# EAGLE design time-twister (EAGLE 6.6.0)

## Sheet 1 of 3
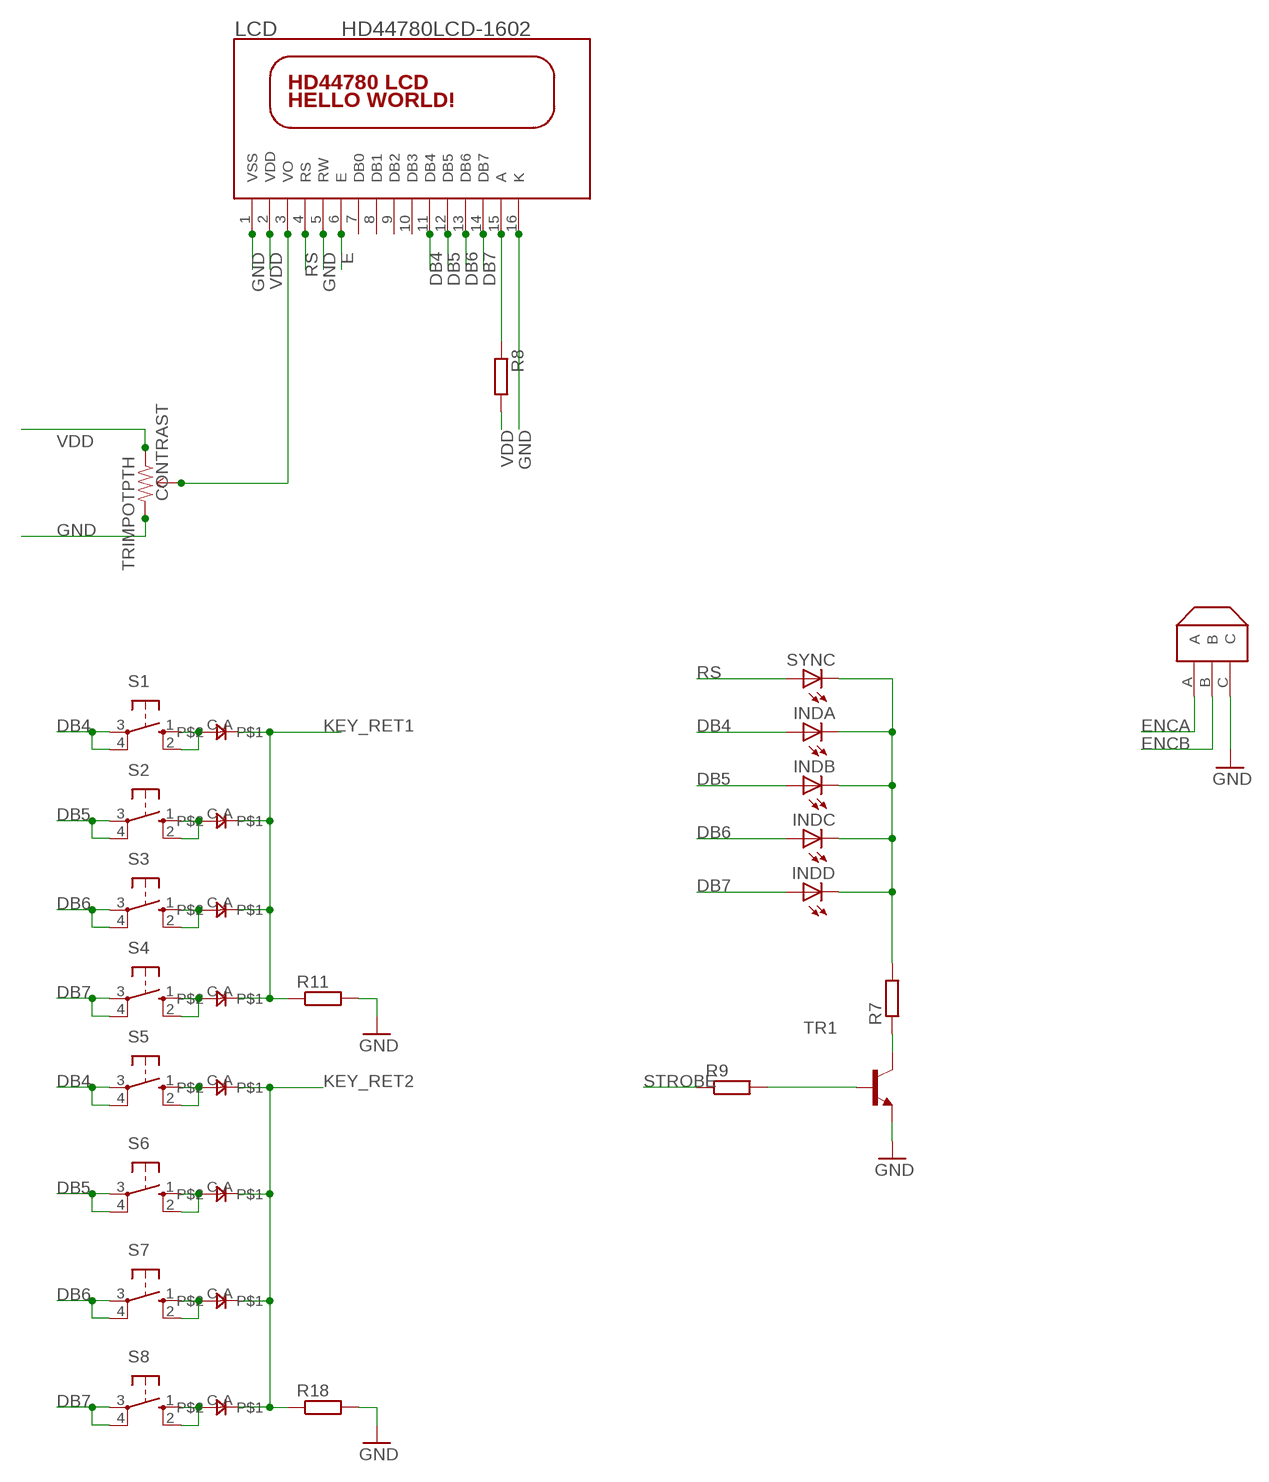
[diagram p0: schematic, sheet 1]

### Parts
CONTRAST  TRIMPOTPTH  [TRIM_POT_PTH]
D5  0805DIODE  [0805DIODE]
D6  0805DIODE  [0805DIODE]
D7  0805DIODE  [0805DIODE]
D8  0805DIODE  [0805DIODE]
D10  0805DIODE  [0805DIODE]
D11  0805DIODE  [0805DIODE]
D12  0805DIODE  [0805DIODE]
D13  0805DIODE  [0805DIODE]
ENC1  ENCODER  [ENCODER]
INDA  LED3MM  [LED3MM]
INDB  LED3MM  [LED3MM]
INDC  LED3MM  [LED3MM]
INDD  LED3MM  [LED3MM]
LCD  HD44780LCD-1602  [LCD1602]
R7  R-EU_R0805  [R0805]
R8  R-EU_R0805  [R0805]
R9  R-EU_R0805  [R0805]
R11  R-EU_R0805  [R0805]
R18  R-EU_R0805  [R0805]
S1  40-XX  [B3F-40XX]
S2  40-XX  [B3F-40XX]
S3  40-XX  [B3F-40XX]
S4  40-XX  [B3F-40XX]
S5  40-XX  [B3F-40XX]
S6  40-XX  [B3F-40XX]
S7  40-XX  [B3F-40XX]
S8  40-XX  [B3F-40XX]
SYNC  LED3MM  [LED3MM]
TR1  MMBT3904LT1-NPN-SOT23-BEC  [SOT23-BEC]

### Nets
DB4: INDA.A LCD.11(DB4) S1.3(P) S1.4(P1) S5.3(P) S5.4(P1) ; also sheet 2
DB5: INDB.A LCD.12(DB5) S2.3(P) S2.4(P1) S6.3(P) S6.4(P1) ; also sheet 2
DB6: INDC.A LCD.13(DB6) S3.3(P) S3.4(P1) S7.3(P) S7.4(P1) ; also sheet 2
DB7: INDD.A LCD.14(DB7) S4.3(P) S4.4(P1) S8.3(P) S8.4(P1) ; also sheet 2
E: LCD.6(E) ; also sheet 2
ENCA: ENC1.A ; also sheet 2
ENCB: ENC1.B ; also sheet 2
GND: CONTRAST.3(CW) ENC1.C LCD.1(VSS) LCD.5(RW) LCD.16(K) R11.2 R18.2 TR1.E ; also sheet 2,3
INDC: INDA.K(C) INDB.K(C) INDC.K(C) INDD.K(C) R7.2 SYNC.K(C)
KEY_RET1: D10.A D11.A D12.A D13.A R11.1 ; also sheet 2
KEY_RET2: D5.A D6.A D7.A D8.A R18.1 ; also sheet 2
LCD_A: LCD.15(A) R8.1
LCD_VO: CONTRAST.2(WIPER) LCD.3(VO)
N$21: R7.1 TR1.C
N$22: D12.C S1.1(S) S1.2(S1)
N$23: D10.C S2.1(S) S2.2(S1)
N$28: D13.C S3.1(S) S3.2(S1)
N$29: D11.C S4.1(S) S4.2(S1)
N$30: D8.C S5.1(S) S5.2(S1)
N$31: D7.C S6.1(S) S6.2(S1)
N$32: D6.C S7.1(S) S7.2(S1)
N$33: D5.C S8.1(S) S8.2(S1)
N$34: R9.2 TR1.B
RS: LCD.4(RS) SYNC.A ; also sheet 2
STROBE: R9.1 ; also sheet 2
VDD: CONTRAST.1(CCW) LCD.2(VDD) R8.2 ; also sheet 2,3
Unconnected: LCD.7(DB0) LCD.8(DB1) LCD.9(DB2) LCD.10(DB3)

## Sheet 2 of 3
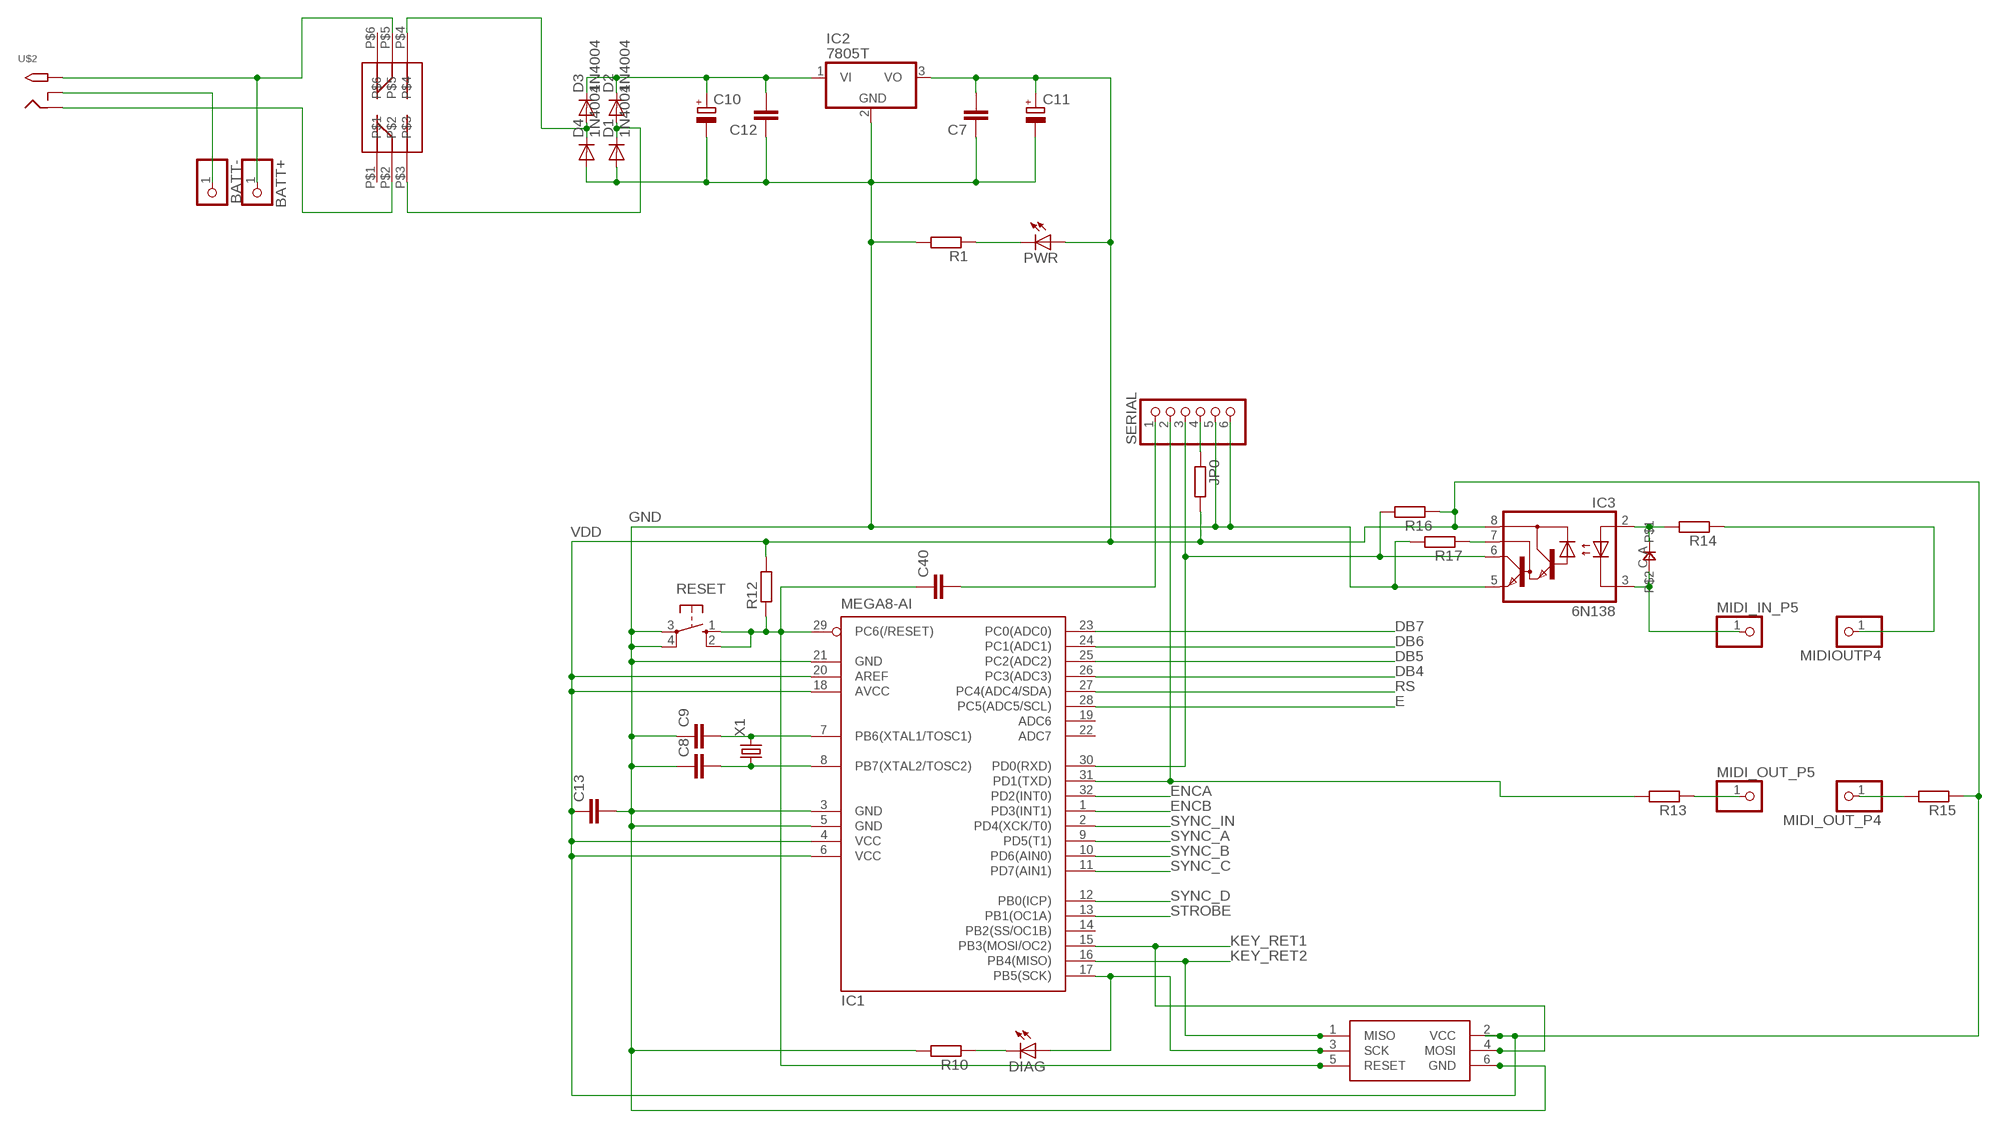
[diagram p1: schematic, sheet 2]

### Parts
BATT+  HEADER-1X1  [1X01_OVAL]
BATT-  HEADER-1X1  [1X01_OVAL]
C7  C-EUC0805  [C0805]
C8  C-EUC0805  [C0805]
C9  C-EUC0805  [C0805]
C10  CPOL-EUE2.5-6  [E2,5-6]
C11  CPOL-EUE2.5-6  [E2,5-6]
C12  C-EUC0805  [C0805]
C13  C-EUC0805  [C0805]
C40  C-EUC0805  [C0805]
D1  1N4004  [DO-VERT]
D2  1N4004  [DO-VERT]
D3  1N4004  [DO-VERT]
D4  1N4004  [DO-VERT]
D9  0805DIODE  [0805DIODE]
DIAG  LED3MM  [LED3MM]
IC1  MEGA8-AI  [TQFP32-08]
IC2  7805T  [TO220H]
IC3  6N138  [DIL08]
JP0  R-EU_R0805  [R0805]
MIDI_IN_P5  HEADER-1X1  [1X01_OVAL]
MIDI_OUT_P4  HEADER-1X1  [1X01_OVAL]
MIDI_OUT_P5  HEADER-1X1  [1X01_OVAL]
MIDIOUTP4  HEADER-1X1  [1X01_OVAL]
ONOFF  2P2T_LATCHING  [2P2T_LATCHING]
PWR  LED3MM  [LED3MM]
R1  R-EU_R0805  [R0805]
R10  R-EU_R0805  [R0805]
R12  R-EU_R0805  [R0805]
R13  R-EU_R0805  [R0805]
R14  R-EU_R0805  [R0805]
R15  R-EU_R0805  [R0805]
R16  R-EU_R0805  [R0805]
R17  R-EU_R0805  [R0805]
RESET  10-XX  [B3F-10XX]
SERIAL  PINHD-1X6  [1X06]
U$2  2.1MMJACKTHM  [PJ-102A]
U$34  TAG_CONN_AVR  [TC2030-MCP-NL]
X1  CRYSTALHC49S  [HC49/S]

### Nets
BLINK: DIAG.A IC1.17(PB5(SCK)) U$34.3(SCK)
DB4: IC1.26(PC3(ADC3)) ; also sheet 1
DB5: IC1.25(PC2(ADC2)) ; also sheet 1
DB6: IC1.24(PC1(ADC1)) ; also sheet 1
DB7: IC1.23(PC0(ADC0)) ; also sheet 1
E: IC1.28(PC5(ADC5/SCL)) ; also sheet 1
ENCA: IC1.32(PD2(INT0)) ; also sheet 1
ENCB: IC1.1(PD3(INT1)) ; also sheet 1
GND: C7.1 C8.1 C9.1 C10.- C11.- C12.1 C13.2 D1.A D4.A IC1.3(GND) IC1.5(GND) IC1.21(GND) IC2.2(GND) IC3.5(GND) R1.2 R10.2 R17.2 RESET.3(P) RESET.4(P1) SERIAL.5 SERIAL.6 U$34.6(GND) ; also sheet 1,3
KEY_RET1: IC1.15(PB3(MOSI/OC2)) U$34.4(MOSI) ; also sheet 1
KEY_RET2: IC1.16(PB4(MISO)) U$34.1(MISO) ; also sheet 1
MIDI_IN_4: MIDI_OUT_P4.1 R15.2
MIDI_IN_P4: MIDIOUTP4.1 R14.1
MIDI_OUT_5: D9.C IC3.3(C) MIDI_IN_P5.1
MIDI_OUT_P5: MIDI_OUT_P5.1 R13.1
N$4: C9.2 IC1.7(PB6(XTAL1/TOSC1)) X1.2
N$5: C8.2 IC1.8(PB7(XTAL2/TOSC2)) X1.1
N$7: C40.1 IC1.29(PC6(/RESET)) R12.1 RESET.1(S) RESET.2(S1) U$34.5(RESET)
N$8: JP0.1 SERIAL.4
N$9: C40.2 SERIAL.1
N$10: IC1.31(PD1(TXD)) R13.2 SERIAL.2
N$11: IC1.30(PD0(RXD)) IC3.6(VO) R16.2 SERIAL.3
N$12: C10.+ C12.2 D2.C D3.C IC2.1(VI)
N$41: BATT+.1 ONOFF.P$5 U$2.TIP
N$42: ONOFF.P$2 U$2.RING
N$43: BATT-.1 U$2.RING_SW
N$44: IC3.7(VB) R17.1
N$45: D9.A IC3.2(A) R14.2
N$50: DIAG.K(C) R10.1
N$51: PWR.K(C) R1.1
N$55: D1.C D2.A ONOFF.P$3
N$56: D3.A D4.C ONOFF.P$4
RS: IC1.27(PC4(ADC4/SDA)) ; also sheet 1
STROBE: IC1.13(PB1(OC1A)) ; also sheet 1
SYNC_A: IC1.9(PD5(T1)) ; also sheet 3
SYNC_B: IC1.10(PD6(AIN0)) ; also sheet 3
SYNC_C: IC1.11(PD7(AIN1)) ; also sheet 3
SYNC_D: IC1.12(PB0(ICP)) ; also sheet 3
SYNC_IN: IC1.2(PD4(XCK/T0)) ; also sheet 3
VDD: C7.2 C11.+ C13.1 IC1.4(VCC) IC1.6(VCC) IC1.18(AVCC) IC1.20(AREF) IC2.3(VO) IC3.8(VCC) JP0.2 PWR.A R12.2 R15.1 R16.1 U$34.2(VCC) ; also sheet 1,3
Unconnected: IC1.14(PB2(SS/OC1B)) IC1.19(ADC6) IC1.22(ADC7) ONOFF.P$1 ONOFF.P$6

## Sheet 3 of 3
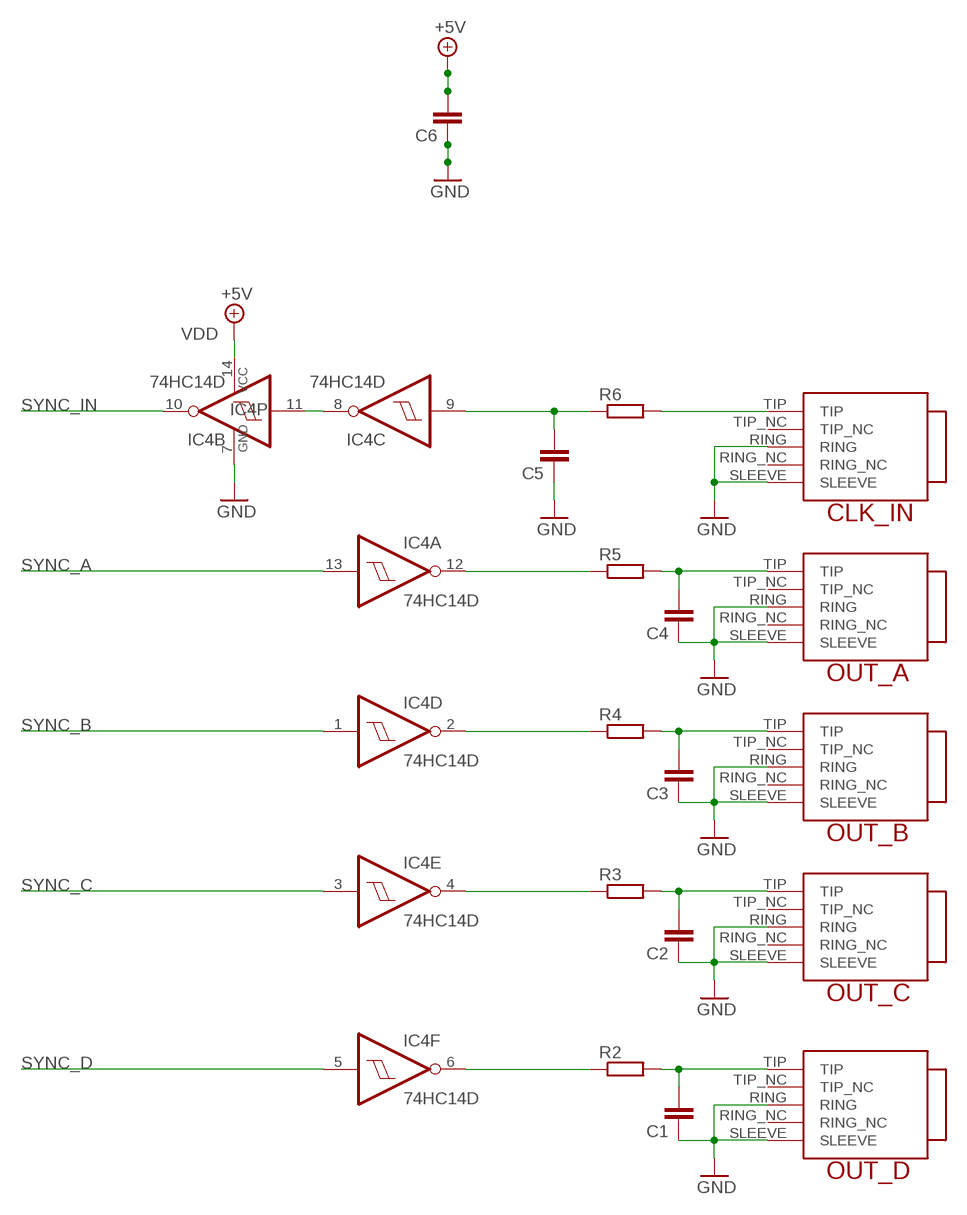
[diagram p2: schematic, sheet 3]

### Parts
C1  C-EUC0805  [C0805]
C2  C-EUC0805  [C0805]
C3  C-EUC0805  [C0805]
C4  C-EUC0805  [C0805]
C5  C-EUC0805  [C0805]
C6  C-EUC0805  [C0805]
CLK_IN  TRUCONNECTJACK  [TRUCONNECTJACK]
IC4  74HC14D  [SO14]
OUT_A  TRUCONNECTJACK  [TRUCONNECTJACK]
OUT_B  TRUCONNECTJACK  [TRUCONNECTJACK]
OUT_C  TRUCONNECTJACK  [TRUCONNECTJACK]
OUT_D  TRUCONNECTJACK  [TRUCONNECTJACK]
R2  R-EU_M0805  [M0805]
R3  R-EU_M0805  [M0805]
R4  R-EU_M0805  [M0805]
R5  R-EU_M0805  [M0805]
R6  R-EU_M0805  [M0805]

### Nets
GND: C1.1 C2.1 C3.1 C4.1 C5.1 C6.1 CLK_IN.RING CLK_IN.SLEEVE IC4.7(P:GND) OUT_A.RING OUT_A.SLEEVE OUT_B.RING OUT_B.SLEEVE OUT_C.RING OUT_C.SLEEVE OUT_D.RING OUT_D.SLEEVE ; also sheet 1,2
N$6: C3.2 OUT_B.TIP R4.2
N$13: C4.2 OUT_A.TIP R5.2
N$14: C2.2 OUT_C.TIP R3.2
N$15: C1.2 OUT_D.TIP R2.2
N$16: CLK_IN.TIP R6.2
N$17: C5.2 IC4.9(C:I) R6.1
N$18: IC4.8(C:O) IC4.11(B:I)
N$24: IC4.6(F:O) R2.1
N$25: IC4.4(E:O) R3.1
N$26: IC4.2(D:O) R4.1
N$27: IC4.12(A:O) R5.1
SYNC_A: IC4.13(A:I) ; also sheet 2
SYNC_B: IC4.1(D:I) ; also sheet 2
SYNC_C: IC4.3(E:I) ; also sheet 2
SYNC_D: IC4.5(F:I) ; also sheet 2
SYNC_IN: IC4.10(B:O) ; also sheet 2
VDD: C6.2 IC4.14(P:VCC) ; supply symbol labelled +5V ; also sheet 1,2
Unconnected: CLK_IN.RING_NC CLK_IN.TIP_NC OUT_A.RING_NC OUT_A.TIP_NC OUT_B.RING_NC OUT_B.TIP_NC OUT_C.RING_NC OUT_C.TIP_NC OUT_D.RING_NC OUT_D.TIP_NC

## Library data of the parts
BATT+ BATT- MIDI_IN_P5 MIDI_OUT_P4 MIDI_OUT_P5 MIDIOUTP4 = microbuilder:HEADER-1X1: PIN HEADER
C1-C9 C12 C13 C40 = rcl:C-EU: CAPACITOR, European symbol
C10 C11 = rcl:CPOL-EU: POLARIZED CAPACITOR, European symbol
CLK_IN OUT_A OUT_B OUT_C OUT_D = jason_eagle6:TRUCONNECTJACK
CONTRAST = SparkFun:TRIMPOT
D1-D4 = jasons_stuff:1N4004: DIODE general purpose rectifier, 1 A
D5-D13 = jasons_stuff:0805DIODE
DIAG INDA INDB INDC INDD SYNC = led:LED: LED
ENC1 = jason_eagle6:ENCODER
IC1 = atmel:MEGA8: MICROCONTROLLER 8 Kbytes FLASH, 1 kbytes SRAM, 512 bytes EEPROM, USART, 6-channel 10 bit ADC, 2-channel 8 bit ADC Pin compatible with Atmega48, ATMega88, ATMega168 Source: avr.lbr
IC2 = linear:78*: Positive VOLTAGE REGULATOR Source: http://cache.national.com/ds/LM/LM78L05.pdf http://www.fairchildsemi.com/ds/LM/LM7805.pdf
IC3 = optocoupler:6N138: MOTOROLA OPTO COUPLER
IC4 = 74xx-eu:74*14: Hex schmitt trigger INVERTER
JP0 R1-R18 = rcl:R-EU_: RESISTOR, European symbol
LCD = adafruit:HD44780LCD: HD44780 LCD Standard character type LCDs, available in sizes from 8x1 to 40x4!
ONOFF = jasons_stuff:2P2T_LATCHING
PWR = adafruit:LED: LED
RESET = switch-omron:10-XX: OMRON SWITCH; MPN: B3F-1000; OC_FARNELL: 176432; OC_NEWARK: 36M3542
S1-S8 = switch-omron:40-XX: OMRON SWITCH; MF: OMRON COMPONENTS USA; MPN: B3F-4000; OC_FARNELL: 176434; OC_NEWARK: 36K3105
SERIAL = pinhead:PINHD-1X6: PIN HEADER
TR1 = transistor:*-NPN-: NPN Transistror BF959 corrected 2008.03.06
U$2 = adafruit:2.1MMJACK: 2.1mm x 5.5mm THM DC jack with internal switch. Digikey part #PJ-102A, 4UCON part #05537 2.1mm x 5.5mm SMT DC jack with internal switch. Digikey part #PJ-002A-SMT, 4UCON part #03267 By microbuilder.eu & adafruit.com
U$34 = jasons_stuff:TAG_CONN_AVR
X1 = crystal:CRYSTAL: CRYSTAL

## Board
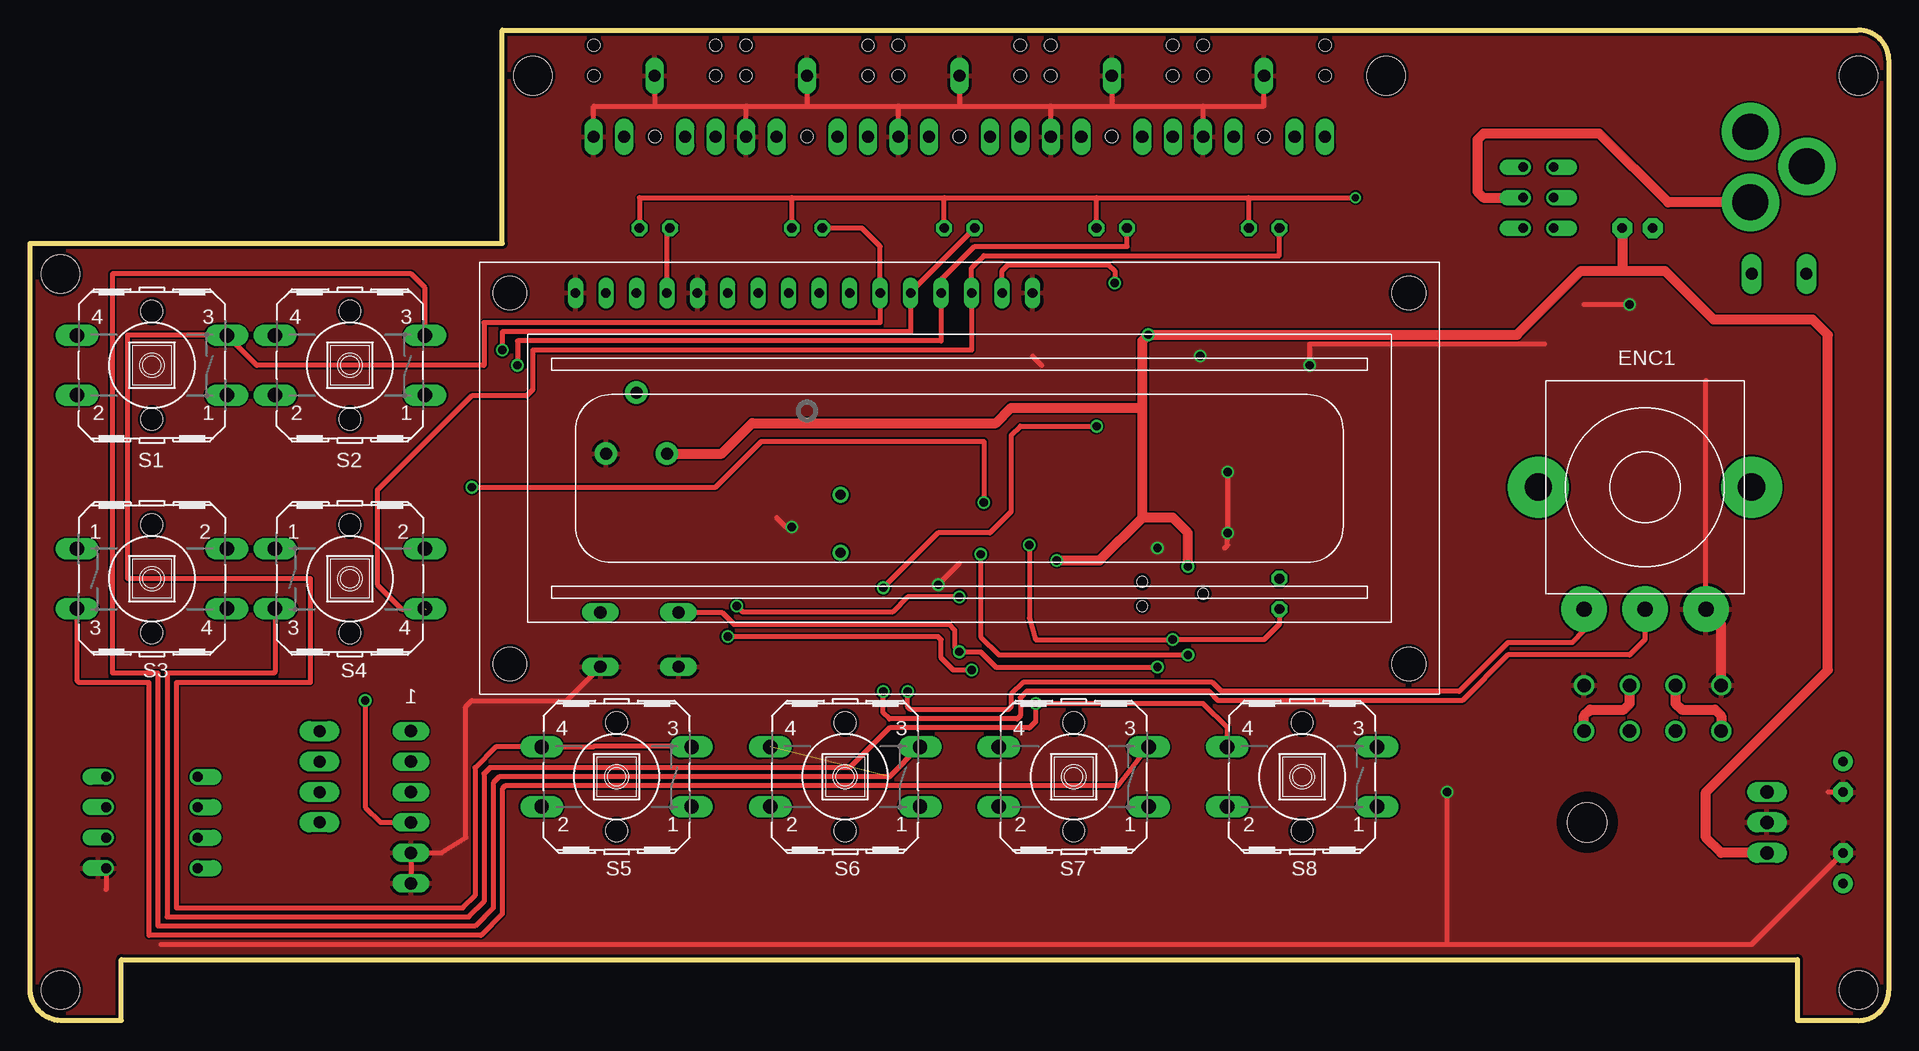
[diagram p3: board, top side]
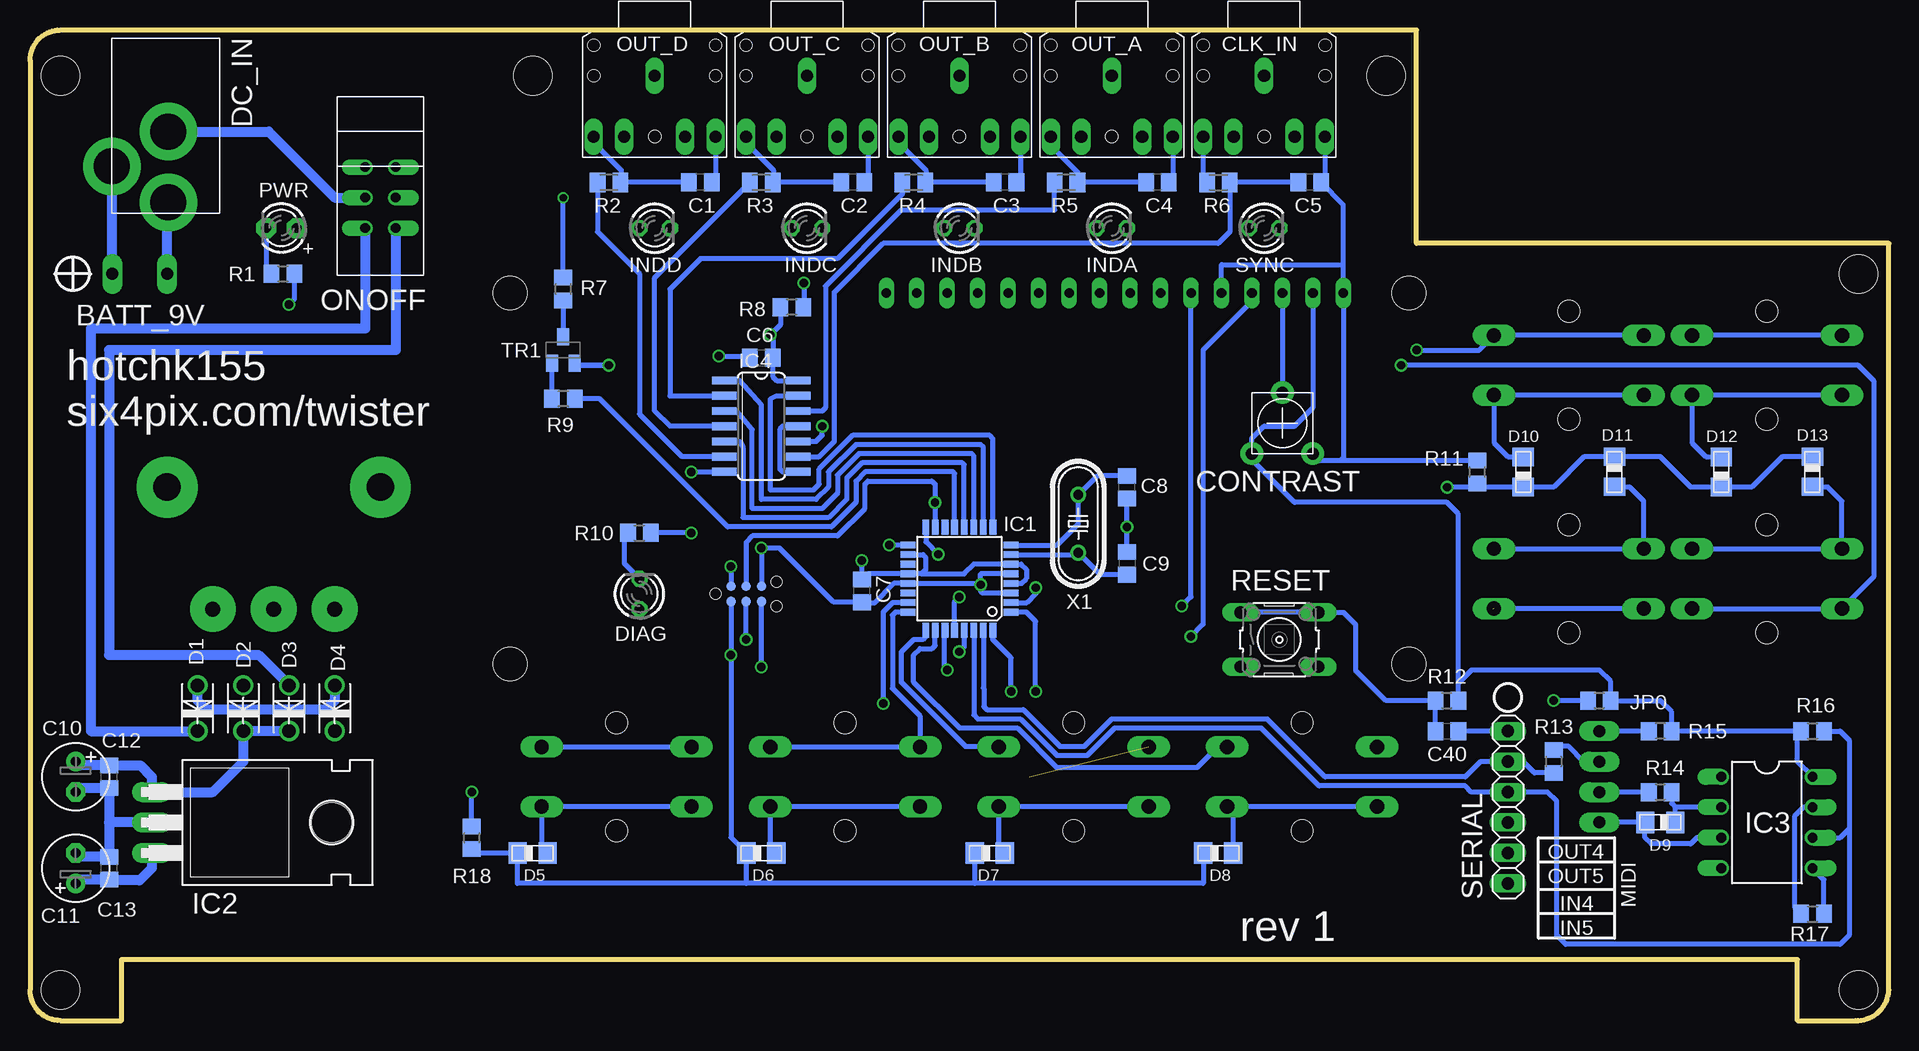
[diagram p4: board, bottom side, seen from below]

Size 154.94 x 82.55 mm. Coordinates in mm from the lower left corner, seen from the top.
Outline: 154.94,80.01 154.94,2.54 arc-90 152.4,0 147.32,0 147.32,5.08 7.62,5.08 7.62,0 2.79,0 arc-90 0,2.54 0,64.77 39.37,64.77 39.37,82.55 152.4,82.55 arc-90 154.94,80.01
Copper layers (1*16): Top 0.035mm / dielectric 1.5mm / Bottom 0.035mm
Design rules "ITEADstudio_DRC": minimum track width 6mil, minimum drill 12mil, track to track 6mil, track to pad 6mil, pad to pad 6mil, via to via 6mil, smd to smd 0mil, copper to edge 10mil, drill to drill 10mil, minimum pad ring 10mil, minimum via ring 6mil, stop-mask expansion 2mil, vias tented up to drill 100mil, thermal gap 10mil
Holes 3.2 mm at 152.4,78.74 152.4,2.54 2.54,62.23 2.54,2.54 41.91,78.74 113.03,78.74

### Footprints (pad centres in the part's own frame; a part is rotated, then mirrored left to right if it is on the bottom)
1X01_OVAL = drill 1 pad 1.676 long: 1 0,0
C0805 = smd 1.3 x 1.5: 1 -0.95,0; 2 0.95,0
E2,5-6 = drill 0.813 pad 1.6: + -1.27,0 | drill 0.813 pad 1.6 octagon: - 1.27,0
TRUCONNECTJACK = drill 1.016 long: RING -1.27,-5.08; RING_NC -1.27,-2.54; SLEEVE 3.81,0; TIP -1.27,5.08; TIP_NC -1.27,2.54 | hole 1.016: 3.81,5.08; 6.35,5.08; 3.81,-5.08; 6.35,-5.08; -1.27,0
TRIM_POT_PTH = drill 1 pad 1.88: 1 -2.54,-2.54; 2 0,2.54; 3 2.54,-2.54
DO-VERT = drill 1.118: A 2.54,0; C -1.27,0
0805DIODE = smd 1.524 x 1.778: A -1.262,-0.005; C 1.238,-0.005
LED3MM = drill 0.813 octagon: A -1.27,0; K 1.27,0
ENCODER = drill 1.27 pad 3.81: A 5.08,10.16; B 0,10.16; C -5.08,10.16 | drill 2.286 pad 5.08: P$1 8.89,0; P$2 -8.89,0
TQFP32-08 = smd 1.27 x 0.559: 1 -4.293,2.8; 2 -4.293,2; 3 -4.293,1.2; 4 -4.293,0.4; 5 -4.293,-0.4; 6 -4.293,-1.2; 7 -4.293,-2; 8 -4.293,-2.8; 17 4.293,-2.8; 18 4.293,-2; 19 4.293,-1.2; 20 4.293,-0.4; 21 4.293,0.4; 22 4.293,1.2; 23 4.293,2; 24 4.293,2.8 | smd 0.559 x 1.27: 9 -2.8,-4.293; 10 -2,-4.293; 11 -1.2,-4.293; 12 -0.4,-4.293; 13 0.4,-4.293; 14 1.2,-4.293; 15 2,-4.293; 16 2.8,-4.293; 25 2.8,4.293; 26 2,4.293; 27 1.2,4.293; 28 0.4,4.293; 29 -0.4,4.293; 30 -1.2,4.293; 31 -2,4.293; 32 -2.8,4.293
TO220H = drill 1.118 long: 1 -2.54,-10.16; 2 0,-10.16; 3 2.54,-10.16 | hole 3.302: 0,4.826
DIL08 = drill 0.813 offset: 1 -3.81,-3.81; 2 -1.27,-3.81; 3 1.27,-3.81; 4 3.81,-3.81; 5 3.81,3.81; 6 1.27,3.81; 7 -1.27,3.81; 8 -3.81,3.81
SO14 = smd 0.66 x 2.032: 1 -3.81,-3.073; 2 -2.54,-3.073; 3 -1.27,-3.073; 4 0,-3.073; 5 1.27,-3.073; 6 2.54,-3.073; 7 3.81,-3.073; 8 3.81,3.073; 9 2.54,3.073; 10 1.27,3.073; 11 0,3.073; 12 -1.27,3.073; 13 -2.54,3.073; 14 -3.81,3.073
R0805 = smd 1.3 x 1.5: 1 -0.95,0; 2 0.95,0
LCD1602 = drill 0.8 long: 1 8,33.46; 2 10.54,33.46; 3 13.08,33.46; 4 15.62,33.46; 5 18.16,33.46; 6 20.7,33.46; 7 23.24,33.46; 8 25.78,33.46; 9 28.32,33.46; 10 30.86,33.46; 11 33.4,33.46; 12 35.94,33.46; 13 38.48,33.46; 14 41.02,33.46; 15 43.56,33.46; 16 46.1,33.46 | hole 2.8: 2.54,2.54; 2.54,33.46; 77.46,33.46; 77.46,2.54
2P2T_LATCHING = drill 0.8 offset: P$1 -1.27,0; P$2 -1.27,-2.54; P$3 -1.27,-5.08; P$4 1.27,-5.08; P$5 1.27,-2.54; P$6 1.27,0
LED3MM' = drill 0.813 pad 1.676 octagon: A -1.27,0; K 1.27,0
M0805 = smd 1.3 x 1.6: 1 -0.95,0; 2 0.95,0
B3F-10XX = drill 1.016 long: 1 -3.251,2.261; 2 3.251,2.261; 3 -3.251,-2.261; 4 3.251,-2.261
B3F-40XX = drill 1.194 long: 1 -6.248,2.489; 2 6.248,2.489; 3 -6.248,-2.489; 4 6.248,-2.489 | hole 1.803: 0,-4.496; 0,4.496
1X06 = drill 1.016 long: 1 -6.35,0; 2 -3.81,0; 3 -1.27,0; 4 1.27,0; 5 3.81,0; 6 6.35,0
SOT23-BEC = smd 1 x 1.4: B -0.95,-1.1; C 0,1.1; E 0.95,-1.1
PJ-102A = drill 3 pad 4.8: RING 0.1,-3.39; RING_SW -4.6,-6.29; TIP 0.1,-9.29
TC2030-MCP-NL = smd 0.787 x 0.787: 1 1.27,-0.635; 2 1.27,0.635; 3 2.54,-0.635; 4 2.54,0.635; 5 3.81,-0.635; 6 3.81,0.635 | hole 0.889: 0,0; 5.08,-1.016; 5.08,1.016
HC49/S = drill 0.813: 1 -2.413,0; 2 2.413,0

### Placement (x,y rotation side)
BATT+  143.51,62.23 0 top
BATT-  148.08,62.23 180 top
C1  99.06,69.85 180 bottom
C2  86.36,69.85 180 bottom
C3  73.66,69.85 180 bottom
C4  60.96,69.85 180 bottom
C5  48.26,69.85 180 bottom
C6  93.98,55.25 0 bottom
C7  85.6,35.81 90 bottom
C8  63.5,44.45 90 bottom
C9  63.5,38.1 270 bottom
C10  151.13,20.32 270 bottom
C11  151.13,12.7 90 bottom
C12  148.34,20.32 90 bottom
C13  148.34,12.7 90 bottom
C40  36.83,24.13 0 bottom
CLK_IN  52.07,74.93 90 bottom
CONTRAST  50.55,49.78 0 bottom
D1  140.97,25.4 90 bottom
D2  137.16,25.4 90 bottom
D3  133.35,25.4 90 bottom
D4  129.54,25.4 90 bottom
D5  113.03,13.97 0 bottom
D6  93.98,13.97 0 bottom
D7  74.93,13.97 0 bottom
D8  55.88,13.97 0 bottom
D9  19.05,16.51 180 bottom
D10  30.48,45.72 90 bottom
D11  22.86,45.72 270 bottom
D12  13.97,45.72 90 bottom
D13  6.35,45.72 270 bottom
DIAG  104.14,35.56 90 bottom
ENC1  134.62,44.45 180 top
IC1  77.47,36.83 180 bottom
IC2  134.62,16.51 270 bottom
IC3  10.16,16.51 270 bottom
IC4  93.98,49.53 270 bottom
INDA  64.77,66.04 0 bottom
INDB  77.47,66.04 0 bottom
INDC  90.17,66.04 0 bottom
INDD  102.87,66.04 0 bottom
JP0  24.13,26.67 0 bottom
LCD  37.47,27.18 0 top
MIDI_IN_P5  24.13,16.51 270 bottom
MIDI_OUT_P4  24.13,24.13 90 bottom
MIDI_OUT_P5  24.13,21.59 270 bottom
MIDIOUTP4  24.13,19.05 270 bottom
ONOFF  125.73,71.12 0 bottom
OUT_A  64.77,74.93 90 bottom
OUT_B  77.47,74.93 90 bottom
OUT_C  90.17,74.93 90 bottom
OUT_D  102.87,74.93 90 bottom
PWR  [LED3MM']  133.99,66.04 180 bottom
R1  133.86,62.23 0 bottom
R2  106.68,69.85 0 bottom
R3  93.98,69.85 0 bottom
R4  81.28,69.85 0 bottom
R5  68.58,69.85 0 bottom
R6  55.88,69.85 180 bottom
R7  110.49,60.96 90 bottom
R8  91.44,59.44 180 bottom
R9  110.49,51.82 180 bottom
R10  104.14,40.64 0 bottom
R11  34.29,45.72 90 bottom
R12  36.83,26.67 0 bottom
R13  27.94,21.59 270 bottom
R14  19.05,19.05 0 bottom
R15  19.05,24.13 180 bottom
R16  6.35,24.13 0 bottom
R17  6.35,8.89 0 bottom
R18  118.11,15.24 90 bottom
RESET  50.8,31.75 0 bottom
S1  10.16,54.61 180 top
S2  26.67,54.61 180 top
S3  10.16,36.83 0 top
S4  26.67,36.83 0 top
S5  48.9,20.32 180 top
S6  67.94,20.32 180 top
S7  87,20.32 180 top
S8  106.05,20.32 180 top
SERIAL  31.75,17.78 270 bottom
SYNC  52.07,66.04 0 bottom
TR1  110.49,55.88 0 bottom
U$2  143.51,77.47 0 bottom
U$34  97.79,35.56 0 bottom
X1  67.56,41.4 270 bottom

### Tracks (layer width: path | path; a pad name or v marks a point on that pad's centre or on a via)
BLINK  (via drill 0.7)
  Top 0.406: v83.31,39.63 83.31,33.53 83.82,31.75 v95.25,31.75 102.87,31.75 104.14,33.02 DIAG.A
  Bottom 0.406: IC1.17 v83.31,39.63 v83.31,39.62 | v95.25,31.75 U$34.3
DB4
  Top 0.406: S5.3 55.09,22.86 46.99,22.86 46.94,22.81 S5.4 38.81,22.81 37.08,21.08 37.08,10.41 36.07,9.4 12.19,9.4 12.19,28.19 23.37,28.19 23.37,36.83 8.13,36.83 8.13,57.15 16.46,57.15 S1.3 18.9,54.61 37.85,54.61 37.85,58.17 70.87,58.17 70.86,58.93 LCD.11 70.86,64.52 69.34,66.04 INDA.A
  Bottom 0.406: S5.3 55.93,22.81 57.66,21.08 69.34,21.08 72.64,24.38 77.47,24.38 81.28,28.19 81.28,30.48 80.77,30.99 79.76,30.99 79.5,31.24 79.5,32.51 IC1.26 | S1.4 S1.3
DB5  (via drill 0.7)  (1 unrouted)
  Top 0.406: S2.3 32.92,61.06 31.75,62.23 6.86,62.23 6.86,28.96 10.67,28.96 10.67,7.87 37.08,7.87 38.61,9.4 38.61,19.81 39.12,20.32 71.63,20.32 74.12,22.81 S6.3 | v39.37,55.88 39.37,57.4 73.41,57.4 73.41,58.93 LCD.12 73.41,60.71 INDB.A
  Bottom 0.406: 74.17,22.84 S6.3 74.24,22.86 76.96,22.86 82.3,28.19 82.3,30.73 81.28,31.75 80.52,31.75 80.3,31.97 80.3,32.51 IC1.25 | v39.37,55.88 34.14,55.88 S2.3 S2.4
DB6  (via drill 0.7)
  Top 0.406: S7.3 93.19,22.86 93.22,22.86 90.68,19.56 39.62,19.56 39.37,19.3 39.37,8.89 37.59,7.11 9.91,7.11 9.91,28.19 4.06,28.19 3.91,28.35 S3.3 | v40.64,54.61 40.64,56.64 75.95,56.64 75.94,59.44 LCD.13 75.94,61.72 78.74,64.52 91.44,64.52 INDC.A
  Bottom 0.406: IC1.24 82.81,34.03 83.06,33.78 83.06,27.69 80.77,25.4 80.77,22.84 S7.4 S7.3 | S3.4 S3.3 1.27,36.98 1.27,53.34 2.54,54.61 v40.64,54.61
DB7  (via drill 0.7)  (1 unrouted)
  Top 0.406: S4.3 20.42,29.06 20.32,28.96 11.43,28.96 11.43,8.64 36.58,8.64 37.85,9.91 37.85,20.57 38.35,21.08 68.33,21.08 71.63,24.38 83.31,24.38 83.82,24.89 v83.82,26.42 97.79,26.42 99.8,24.41 S8.4 | 33.02,34.29 30.99,34.29 28.96,36.32 28.96,44.2 36.83,52.07 41.4,52.07 41.91,52.58 41.91,55.88 78.49,55.88 78.48,59.44 LCD.14 78.48,62.74 79.5,63.75 104.14,63.75 INDD.A
  Bottom 0.406: IC1.23 83.03,34.83 83.82,34.04 v83.82,26.42 | S8.3 S8.4 | S4.3 S4.4
E  (via drill 0.7)
  Top 0.406: v77.47,35.31 73.15,35.31 71.88,34.04 59.44,34.04 v58.93,34.54
  Bottom 0.406: IC1.28 77.87,34.91 v77.47,35.31 | v58.93,34.54 58.17,35.31 58.17,60.39 LCD.6
ENCA  (via drill 0.7)
  Top 0.406: ENC1.A 129.54,32.51 128.52,31.5 123.19,31.5 119.13,27.43 99.31,27.43 98.55,28.19 82.8,28.19 81.79,27.18 81.79,26.16 81.53,25.91 73.41,25.91 73.15,26.16 v73.15,27.43
  Bottom 0.406: v73.15,27.43 73.15,30.23 74.68,31.75 IC1.32
ENCB  (via drill 0.7)
  Top 0.406: ENC1.B 134.62,31.75 133.35,30.48 123.19,30.48 119.38,26.67 99.06,26.67 98.3,27.43 83.06,27.43 82.55,26.92 82.55,25.4 82.3,25.15 71.63,25.15 71.12,25.65 v71.12,27.43
  Bottom 0.406: v71.12,27.43 71.12,33.27 71.88,34.04 IC1.1
GND  (via drill 0.7)
  Top 0.406: CLK_IN.RING 46.99,76.2 52.07,76.2 | 52.07,76.2 59.69,76.2 | 59.69,76.2 64.77,76.2 | 64.77,76.2 72.39,76.2 | 72.39,76.2 77.47,76.2 | 77.47,76.2 85.09,76.2 | 85.09,76.2 90.17,76.2 | 90.17,76.2 97.79,76.2 | 97.79,76.2 OUT_D.RING | 97.79,76.2 102.87,76.2 OUT_D.SLEEVE | OUT_C.SLEEVE 90.17,76.2 | OUT_B.SLEEVE 77.47,76.2 | OUT_A.SLEEVE 64.77,76.2 | CLK_IN.SLEEVE 52.07,76.2 | OUT_A.RING 59.69,76.2 | OUT_B.RING 72.39,76.2 | OUT_C.RING 85.09,76.2 | SERIAL.6 SERIAL.5 34.29,13.97 36.32,15.24 36.32,26.16 36.83,26.67 44.73,26.67 RESET.4 | v106.68,54.61 106.68,56.39 126.24,56.39 | 129.54,59.69 v133.35,59.69 | ENC1.C 139.7,53.34 | C10.- 149.86,19.05 | IC3.5 6.35,10.92 | 10.92,6.35 118.11,6.35 | 118.11,6.35 143.51,6.35 C11.- | v118.11,19.05 118.11,6.35 | 83.56,55.37 84.33,54.61 | v99.82,45.72 v99.82,40.64 99.82,39.62 99.57,39.37 | v75.69,36.32 77.47,38.1 | v63.5,41.15 62.99,41.15 62.23,41.91
  Top 0.813: D1.A 140.97,33.02 ENC1.C
  Bottom 0.406: CLK_IN.RING 46.99,70.17 C5.1 45.47,68.01 45.47,62.99 | OUT_A.RING 59.69,69.85 C4.1 | OUT_B.RING 72.39,70.17 C3.1 | OUT_C.RING 85.09,70.17 C2.1 | OUT_D.RING 97.79,70.17 C1.1 | 45.47,62.99 LCD.1 45.47,46.93 45.72,46.67 | LCD.5 55.62,62.99 55.63,62.99 45.47,62.99 | C8.1 v63.5,41.15 C9.1 | R17.2 5.4,11.75 IC3.5 | 45.72,46.67 47.43,46.67 CONTRAST.3 | R1.2 132.91,60.13 v133.35,59.69 | v99.82,45.72 IC4.7 | R18.2 v118.11,19.05 | IC1.3 75.55,35.63 75.69,35.74 v75.69,36.32 | U$34.6 v93.98,39.37 92.46,39.37 87.95,34.86 C7.1 85.53,34.8 84.58,34.8 82.95,36.43 IC1.21 75.8,36.43 v75.69,36.32 | v99.82,40.64 R10.2 | IC1.5 75.69,37.23 v75.69,36.32 | v97.54,55.37 95.06,55.37 C6.1 | R11.2 45.72,46.67 | v106.68,54.61 109.37,54.61 TR1.E 109.54,54.68 109.47,54.61 v106.68,54.61
  Bottom 0.813: D4.A 129.54,26.67 130.3,25.91 140.21,25.91 140.97,26.67 D1.A | C11.- 150.81,13.65 C13.2 148.34,16.51 | C10.- 150.81,19.37 C12.1 148.34,16.51 | IC2.2 148.34,16.51
  pour Top: -6.35,85.09 -6.35,-3.81 161.29,-3.81 161.29,88.9 -6.35,88.9
INDC  (via drill 0.6)
  Top 0.406: 63.5,68.58 50.8,68.58 SYNC.K | 63.5,68.58 76.2,68.58 | 76.2,68.58 88.9,68.58 | 88.9,68.58 101.6,68.58 | 101.6,68.58 v110.49,68.58 | INDB.K 76.2,68.58 | INDA.K 63.5,68.58 | INDC.K 88.9,68.58 | INDD.K 101.6,68.58
  Bottom 0.406: R7.2 v110.49,68.58
KEY_RET1  (via drill 0.7)
  Top 0.406: v36.83,44.45 57.15,44.45 60.96,48.26 79.5,48.26 v79.5,43.18
  Bottom 0.406: D13.A 8.9,46.98 11.43,44.45 D12.A 16.52,44.46 19.05,46.99 D11.A 25.41,46.98 27.94,44.45 30.47,44.45 D10.A 33.98,44.46 R11.1 34.29,44.45 v36.83,44.45 | U$34.4 95.25,39.88 94.74,40.39 87.63,40.39 85.34,42.67 85.34,44.7 85.09,44.96 79.76,44.96 79.5,44.7 v79.5,43.18 79.47,43.15 IC1.15
KEY_RET2  (via drill 0.7)
  Top 0.406: v79.25,38.86 79.25,32 80.77,30.48 v96.52,30.48
  Bottom 0.406: D8.A 57.14,11.44 57.15,11.43 76.2,11.43 | 76.2,11.43 95.25,11.43 | 95.25,11.43 114.3,11.43 114.3,13.96 D5.A 117.78,13.97 R18.1 | 95.25,11.43 95.24,11.44 D6.A 96.52,15.24 v96.52,30.48 U$34.1 | D7.A 76.19,11.44 76.2,11.43 | IC1.16 80.27,39.88 v79.25,38.86
LCD_A  (via drill 0.7)
  Top 0.406: LCD.15 81.03,62.48 81.53,62.99 89.92,62.99 90.42,62.48 v90.42,61.47
  Bottom 0.406: v90.42,61.47 90.42,59.5 R8.1
LCD_VO
  Bottom 0.406: LCD.3 CONTRAST.2
MIDI_IN_4
  Bottom 0.406: R15.2 MIDI_OUT_P4.1
MIDI_IN_P4
  Bottom 0.406: R14.1 MIDIOUTP4.1
MIDI_OUT_5
  Bottom 0.406: MIDI_IN_P5.1 D9.C 20.32,16.48 20.32,15.24 19.81,14.73 16.51,14.73 16,15.24 IC3.3
MIDI_OUT_P5
  Bottom 0.406: MIDI_OUT_P5.1 25.4,21.59 26.67,22.86 27.62,22.86 R13.1
N$4
  Bottom 0.406: IC1.7 67.72,38.83 X1.2 65.72,37.15 C9.2
N$5
  Bottom 0.406: IC1.8 69.34,39.63 67.56,41.4 X1.1 65.98,45.4 C8.2
N$6
  Bottom 0.406: OUT_B.TIP 82.55,73.15 80.26,70.87 80.26,69.92 R4.2 C3.2
N$7  (via drill 0.7)
  Top 0.406: RESET.1 57.68,34.01 58.67,33.02 76.59,33.02 IC1.29 77.07,31.13 v77.47,30.73 79.25,30.73 80.52,29.46 v93.98,29.46
  Bottom 0.406: C40.1 R12.1 41.91,26.67 44.45,29.21 44.45,33.02 45.44,34.01 RESET.2 RESET.1 | IC1.29 77.07,31.13 v77.47,30.73 | v93.98,29.46 U$34.5
N$8  (via drill 0.7)
  Top 0.406: v27.94,26.67 27.94,17.78 29.21,16.51 SERIAL.4
  Bottom 0.406: JP0.1 v27.94,26.67
N$9
  Bottom 0.406: SERIAL.1 C40.2
N$10
  Bottom 0.406: R13.2 29.53,20.64 30.48,21.59 SERIAL.2 34.04,21.59 35.31,20.32 46.99,20.32 51.82,25.15 64.77,25.15 67.06,22.86 69.09,22.86 72.14,25.91 75.18,25.91 75.44,26.16 75.44,27.69 75.47,27.72 IC1.31
N$11
  Bottom 0.406: R16.2 4.06,24.13 3.3,23.37 3.3,16 | IC3.6 4.06,15.24 3.3,16 | 3.3,16 3.3,7.11 4.06,6.35 26.92,6.35 27.69,7.11 27.69,18.29 28.45,19.05 SERIAL.3 34.8,19.05 35.31,19.56 47.5,19.56 52.32,24.38 64.52,24.38 66.8,22.1 69.34,22.1 72.39,25.15 75.95,25.15 76.27,25.47 IC1.30
N$12
  Bottom 0.813: D3.C D2.C 137.16,21.59 139.7,19.05 IC2.1 144.78,20.32 145.73,21.27 C12.2 150.81,21.27 C10.+
N$13
  Bottom 0.406: OUT_A.TIP 69.85,72.9 67.56,70.61 67.56,69.92 R5.2 C4.2
N$14
  Bottom 0.406: OUT_C.TIP 95.25,73.15 92.96,70.87 92.96,69.92 R3.2 C2.2
N$15
  Bottom 0.406: OUT_D.TIP 107.95,73.15 105.66,70.87 105.66,69.92 R2.2 C1.2
N$16
  Bottom 0.406: CLK_IN.TIP 57.15,69.85 R6.2
N$17
  Bottom 0.406: C5.2 R6.1 54.93,65.72 55.88,64.77 83.82,64.77 87.88,60.71 87.88,48.26 89.15,46.99 IC4.9
N$18
  Bottom 0.406: IC4.11 92.2,49.53 92.46,49.28 92.46,45.97 92.2,45.72 IC4.8
N$21
  Bottom 0.406: R7.1 TR1.C
N$22
  Bottom 0.406: D12.C 14,46.99 15.24,46.99 16.41,48.16 S1.1 S1.2
N$23
  Bottom 0.406: D10.C 30.51,46.99 31.75,46.99 32.92,48.16 S2.1 S2.2
N$24
  Bottom 0.406: IC4.6 100.58,46.99 104.14,50.55 104.14,62.23 107.63,65.72 R2.1
N$25
  Bottom 0.406: IC4.4 101.6,49.53 102.87,50.8 102.87,61.91 R3.1
N$26
  Bottom 0.406: R4.1 82.23,68.9 87.63,63.5 99.06,63.5 101.6,60.96 101.6,52.07 IC4.2
N$27
  Bottom 0.406: IC4.12 88.9,50.8 88.65,51.05 88.65,61.21 82.3,67.56 69.53,67.56 R5.1
N$28
  Bottom 0.406: D13.C 6.32,44.45 5.08,44.45 3.91,43.28 S3.1 S3.2
N$29
  Bottom 0.406: S4.1 20.42,43.28 21.59,44.45 22.83,44.45 D11.C | S4.2 S4.1 | S4.1 20.37,39.32 20.32,39.37 20.37,39.37 S4.1
N$30
  Bottom 0.406: D8.C 54.64,17.33 S5.1 S5.2
N$31
  Bottom 0.406: D7.C 74.19,14.47 S6.1 S6.2
N$32
  Bottom 0.406: D6.C 92.71,13.97 93.24,14.5 S7.1 S7.2
N$33
  Bottom 0.406: D5.C 112.29,14.47 S8.1 S8.2
N$34
  Bottom 0.406: R9.2 TR1.B
N$41
  Top 0.813: U$2.TIP 136.54,68.18 130.81,73.91 121.16,73.91 120.65,73.41 120.65,69.09 121.16,68.58 ONOFF.P$5
  Bottom 0.813: BATT+.1 143.51,68.08 U$2.TIP
N$42
  Bottom 0.813: U$2.RING 135.04,74.08 129.54,68.58 ONOFF.P$2
N$43
  Bottom 0.813: BATT-.1 148.08,71.15 U$2.RING_SW
N$44
  Bottom 0.406: IC3.7 7.11,17.78 7.87,17.02 7.87,9.46 R17.1
N$45
  Bottom 0.406: IC3.2 17.78,17.78 | R14.2 18.1,18.1 17.78,17.78 | D9.A 17.79,17.77 17.78,17.78
N$50
  Bottom 0.406: R10.1 105.41,40.32 105.41,38.1 DIAG.K
N$51
  Bottom 0.406: PWR.K 135.25,62.68 R1.1
N$55
  Top 0.813: D2.A 137.16,26.42 137.67,25.91 140.46,25.91 140.97,25.4 D1.C
  Bottom 0.813: ONOFF.P$3 127,57.66 149.86,57.66 149.86,24.13 D1.C
N$56
  Top 0.813: D4.C 129.54,25.4 130.05,25.91 132.84,25.91 133.35,26.42 D3.A
  Bottom 0.813: ONOFF.P$4 124.46,55.88 148.34,55.88 148.34,30.48 135.89,30.48 D3.A
RS  (via drill 0.7)
  Top 0.406: v78.49,29.21 76.96,29.21 75.95,30.23 75.95,31.75 75.69,32 v58.17,32 | SYNC.A 53.09,65.79 LCD.4
  Bottom 0.406: IC1.27 78.74,32.47 78.74,29.46 v78.49,29.21 | v58.17,32 57.15,33.02 57.15,55.88 53.09,59.94 LCD.4
STROBE
  Bottom 0.406: R9.1 107.44,51.82 96.77,41.15 88.14,41.15 86.11,43.18 86.11,44.96 85.34,45.72 77.98,45.72 77.87,45.61 IC1.13
SYNC_A
  Bottom 0.406: IC4.13 92.71,52.07 93.22,51.82 93.22,44.2 89.66,44.2 89.15,44.7 89.15,45.97 86.36,48.77 74.93,48.77 74.67,48.51 IC1.9
SYNC_B
  Bottom 0.406: IC4.1 95.76,53.34 93.98,51.31 93.98,43.43 89.41,43.43 88.39,44.45 88.39,45.72 86.11,48.01 75.69,48.01 75.47,47.78 IC1.10
SYNC_C
  Bottom 0.406: IC4.3 96.01,50.8 94.74,49.28 94.74,42.67 88.9,42.67 87.63,43.94 87.63,45.47 85.85,47.24 76.45,47.24 76.27,47.06 IC1.11
SYNC_D
  Bottom 0.406: IC4.5 95.76,48.26 95.5,47.75 95.5,41.91 88.39,41.91 86.87,43.43 86.87,45.21 85.6,46.48 77.22,46.48 77.07,46.34 IC1.12
SYNC_IN  (via drill 0.7)
  Top 0.406: v88.9,49.53 82.55,49.53 81.79,48.77 81.79,42.42 80.01,40.64 75.69,40.64 v71.12,36.07
  Bottom 0.406: IC1.2 71.85,34.83 71.12,35.56 v71.12,36.07 | IC4.10 89.41,48.26 88.9,48.77 v88.9,49.53
VDD  (via drill 0.7)
  Top 0.813: IC2.3 140.97,13.97 139.7,15.24 139.7,19.05 149.86,29.21 149.86,57.15 148.59,58.42 140.34,58.42 136.27,62.48 132.84,62.48 | 132.84,62.48 129.29,62.48 123.95,57.15 v93.22,57.15 92.71,56.64 92.71,51.05 | PWR.A 132.72,62.61 132.84,62.48 | v85.6,38.35 89.15,38.35 92.71,41.91 | 92.71,41.91 92.71,51.05 | v96.52,37.85 96.52,40.64 95.25,41.91 92.71,41.91 | CONTRAST.1 57.66,47.24 60.2,49.78 80.52,49.78 81.79,51.05 92.71,51.05
  Bottom 0.406: LCD.2 48.01,51.06 49.53,49.53 52.07,49.53 53.09,48.51 CONTRAST.1 53.09,46.74 49.53,43.18 36.83,43.18 35.88,42.23 35.88,28.13 | IC3.8 7.62,21.59 7.62,23.81 R16.1 R15.1 18.1,25.72 19.05,26.67 JP0.2 23.18,28.26 24.13,29.21 34.8,29.21 35.88,28.13 | R12.2 35.88,28.13 | IC4.14 92.71,53.34 93.03,53.66 C6.2 92.96,55.31 92.96,56.9 v93.22,57.15 92.39,57.98 R8.2 | IC1.4 72.28,36.43 71.88,36.83 71.88,37.59 72.32,38.03 IC1.6 76.27,38.03 77.07,37.23 80.63,37.23 | IC1.18 80.49,38.83 80.26,38.61 80.26,37.59 80.63,37.23 | v85.6,38.35 C7.2 85.13,37.23 IC1.20 80.63,37.23 | v96.52,37.85 U$34.2
  Bottom 0.813: IC2.3 144.78,12.7 145.8,11.68 148.52,11.68 C13.1 150.81,11.75 C11.+

### Text on the board
tNames: 1
bNames: DC_IN | ONOFF | BATT_9V | hotchk155 | six4pix.com/twister | OUT4 | OUT5 | MIDI | IN4 | IN5 | rev 1